# Altium schematic sheet POWERSTAGE.SchDoc
size A4
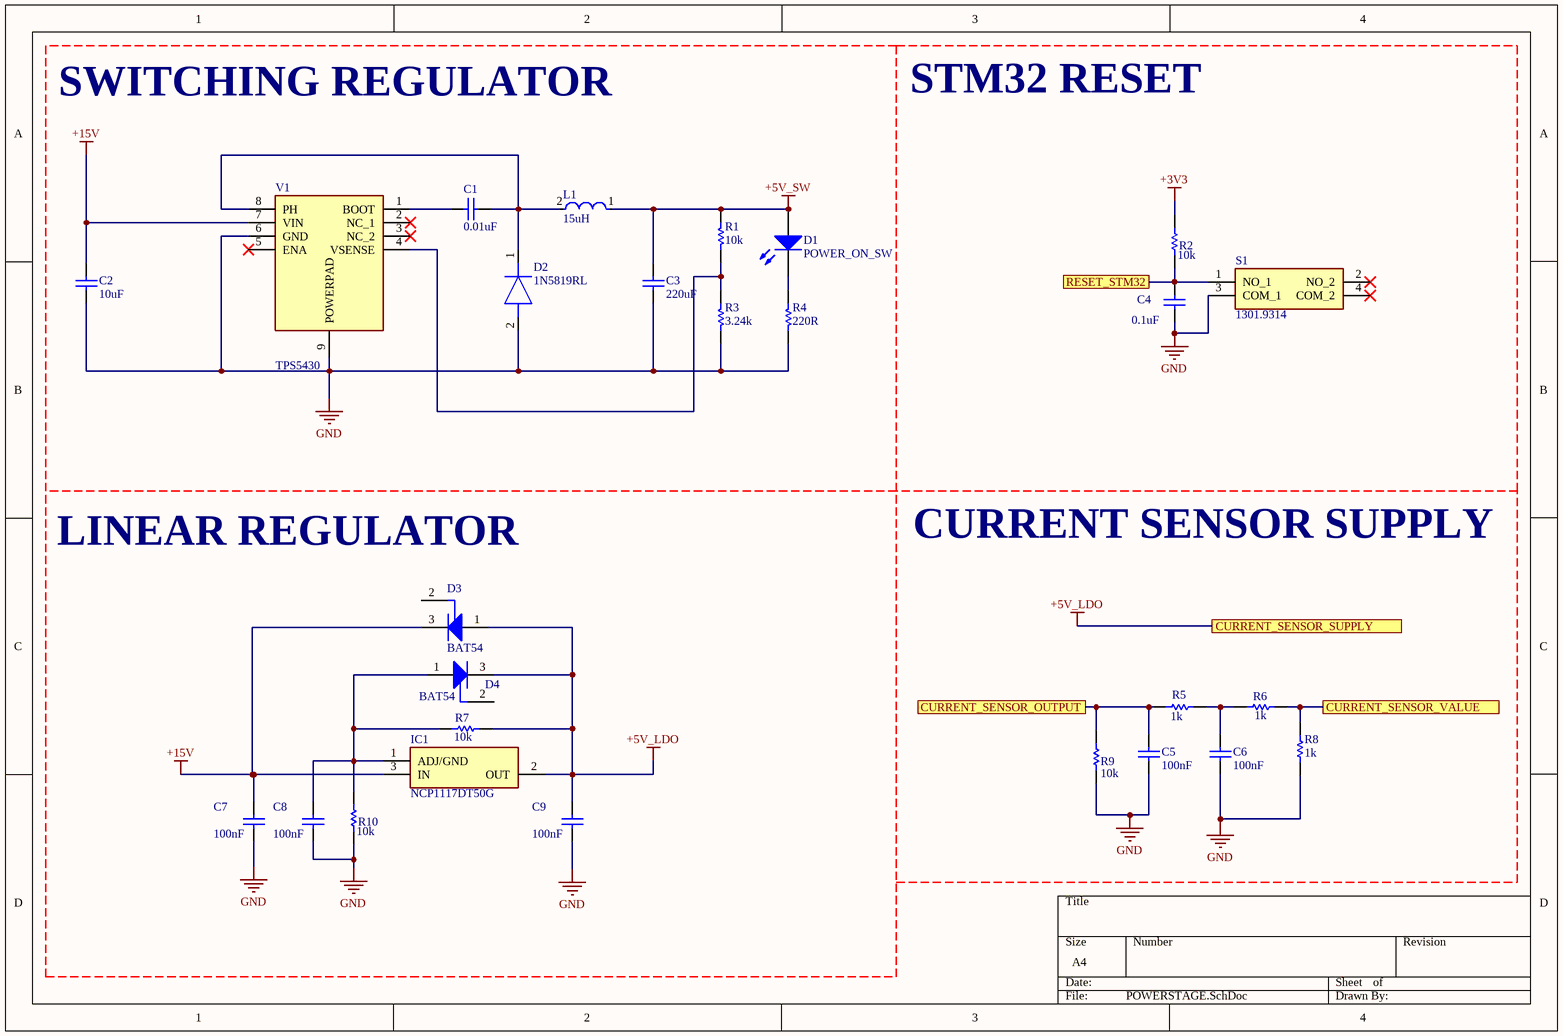
[diagram p0: POWERSTAGE.SchDoc]

## Parts
C1  0.01uF  [KEMT-1206-2_N]
C2  10uF  [KEMT-1206-2_N]
C3  220uF  [KEMT-1206-2_N]
C4  0.1uF  [KEMT-1206-2_N]
C5  100nF  [KEMT-1206-2_N]
C6  100nF  [KEMT-1206-2_N]
C7  100nF  [KEMT-1206-2_N]
C8  100nF  [KEMT-1206-2_N]
C9  100nF  [KEMT-1206-2_N]
D1  POWER_ON_SW  [3.2X1.6X1.1]
D2  1N5819RL  [DIOAD1414W86L464D238]
D3  BAT54  [INF-SOT23_N]
D4  BAT54  [INF-SOT23_N]
IC1  NCP1117DT50G  [LM317MADTRKG]
L1  15uH  [FP-IR02-MFG]
R1  10k  [RESC3216X60X45NL10T20 - duplicate]
R2  10k  [RESC3216X60X45NL10T20 - duplicate]
R3  3.24k  [RESC3216X60X45NL10T20 - duplicate]
R4  220R  [RESC3216X60X45NL10T20 - duplicate]
R5  1k  [R1206]
R6  1k  [R1206]
R7  10k  [RESC3216X60X45NL10T20 - duplicate]
R8  1k  [R1206]
R9  10k  [R1206]
R10  10k  [RESC3216X60X45NL10T20 - duplicate]
S1  1301.9314  [13019319]
V1  TPS5430  [TPS5430]

## Ports
CURRENT_SENSOR_OUTPUT, CURRENT_SENSOR_SUPPLY, CURRENT_SENSOR_VALUE, RESET_STM32

## Nets
+3V3: R2.2
+5V_LDO: C9.1 D3.1(A) D4.3(K) IC1.2(OUT) R7.1 ; port CURRENT_SENSOR_SUPPLY
+5V_SW: C3.2 D1.1(A) L1.1 R1.2
+15V: C2.2 C7.1 D3.3(K) IC1.3(IN) V1.7(VIN)
GND: C2.1 C3.1 C4.1 C5.1 C6.1 C7.2 C8.2 C9.2 D2.2(A) R3.1 R4.1 R8.2 R9.2 R10.1 S1.3(COM_1) V1.6(GND) V1.9(POWERPAD)
CURRENT_SENSOR_OUTPUT: C5.2 R5.2 R9.1 ; port CURRENT_SENSOR_OUTPUT
CURRENT_SENSOR_VALUE: R6.1 R8.1 ; port CURRENT_SENSOR_VALUE
RESET_STM32: C4.2 R2.1 S1.1(NO_1) ; port RESET_STM32
NetC1_1: C1.1 D2.1(K) L1.2 V1.8(PH)
NetC1_2: C1.2 V1.1(BOOT)
NetC6_2: C6.2 R5.1 R6.2
NetC8_1: C8.1 D4.1(A) IC1.1(ADJ/GND) R7.2 R10.2
NetD1_2: D1.2(K) R4.2
NetR1_1: R1.1 R3.2 V1.4(VSENSE)

Not connected (* = marked no-connect by the designer): D3 2(NC); D4 2(NC); S1 2(NO_2)* 4(COM_2)*; V1 2(NC_1)* 3(NC_2)* 5(ENA)*

## Notes on the sheet
- SWITCHING REGULATOR
- STM32 RESET
- LINEAR REGULATOR
- CURRENT SENSOR SUPPLY

## Library data of the parts
C1-C4 = CAPACITOR: CAP, Ceramic, 0.1 uF, +/- 10%, 50 V, -55 to 125 degC, 1206 (3216 Metric), RoHS, Tape and Reel; Manufacturer: Kemet; Voltage Rating: 50V; Capacitance: 0.1µF; Product Range: KEMET-CSeries; SVHC: ToBeAdvised; Dielectric Characteristic: X7R; Capacitor Case Style: 1206[3216Metric]; Package Reference: 1206-2; Package Description: 2-Leads SMD, Body 3.2 x 1.6 mm; Packaging: Tape&Reel; Operating Temperature Max: 125degC; Capacitance Tolerance: ±10%; Datasheet URL: https://datasheet.ciiva.com/6125/1725438-6125494.pdf; Manufacturer URL: http://www.kemet.com/; Operating Temperature Min: -55degC; Datasheet Version: Jul-13
C5-C9 = CMP-1037-04202-2: CAP, Ceramic, 0.1 uF, +/- 10%, 50 V, -55 to 125 degC, 1206 (3216 Metric), RoHS, Tape and Reel; Manufacturer: Kemet; Voltage Rating: 50V; Capacitance: 0.1µF; Product Range: KEMET-CSeries; SVHC: ToBeAdvised; Dielectric Characteristic: X7R; Capacitor Case Style: 1206[3216Metric]; Package Reference: 1206-2; Package Description: 2-Leads SMD, Body 3.2 x 1.6 mm; Packaging: Tape&Reel; Operating Temperature Max: 125degC; Capacitance Tolerance: ±10%; Datasheet URL: https://datasheet.ciiva.com/6125/1725438-6125494.pdf; Manufacturer URL: http://www.kemet.com/; Operating Temperature Min: -55degC; Datasheet Version: Jul-13
D1 = LED2: Typical RED, GREEN, YELLOW, AMBER GaAs LED; Published: 8-Jun-2000; LatestRevisionDate: 17-Jul-2002; LatestRevisionNote: Re-released for DXP Platform.; PackageVersion: Feb-2002; PackageReference: 3.2X1.6X1.1; Publisher: Altium Limited; PackageDescription: SM LED; 2 Flat Leads
D2 = 1N5819RL: Diode; Manufacturer_Name: STMicroelectronics; Datasheet Link: http://www.st.com/web/en/resource/technical/document/datasheet/CD00001625.pdf; Manufacturer_Part_Number: 1N5819RL; Mouser Part Number: 511-1N5819-TR; Mouser Price/Stock: https://www.mouser.co.uk/ProductDetail/STMicroelectronics/1N5819RL?qs=mRqUSD7FX17%2FYMiCEfKDjA%3D%3D; Arrow Part Number: 1N5819RL; Arrow Price/Stock: https://www.arrow.com/en/products/1n5819rl/stmicroelectronics?region=europe
D3 D4 = CMP-1182-00010-1: Silicon Schottky Diode, SOT23, Reel, Green; Manufacturer: Infineon; VF (max): 800Â mV; Configuration: Single; IF (max): 200Â mA; CT (max): 10Â pF; Green: TRUE; VR (max): 30Â V; PartNumber: BAT54; ComponentLink2URL: http://www.infineon.com/dgdl/bat54series.pdf?folderId=db3a30431400ef68011425f1ca2505e3&fileId=db3a304314dca3890115190b74210ea6; ComponentLink3Description: Package Specification; PackageVersion: Apr-08; PackageDescription: 3-Pin Small Outline Transistor Package, 1.3 x 2.9 mm Body, 0.95 mm Pitch; ComponentLink1Description: Manufacturer URL; ComponentLink1URL: http://www.infineon.com/; Mounting Technology: Surface Mount; Packing: Reel; ComponentLink2Description: Datasheet; PackageReference: SOT23; ComponentLink3URL: http://www.infineon.com/dgdl/SOT23-Package_Overview.pdf?folderId=db3a30431936bc4b0119532290053c66&fileId=db3a30431936bc4b0119533468123c85
IC1 = NCP1117DT50G: Integrated Circuit; Manufacturer_Name: onsemi; Datasheet Link: https://componentsearchengine.com/Datasheets/2/NCP1117DT50G.pdf; Height: 2.38mm; Manufacturer_Part_Number: NCP1117DT50G; Mouser Part Number: 863-NCP1117DT50G; Mouser Price/Stock: https://www.mouser.co.uk/ProductDetail/onsemi/NCP1117DT50G?qs=Gev%252BmEvV0iaXyZQB7E2Yhg%3D%3D; Arrow Part Number: NCP1117DT50G; Arrow Price/Stock: https://www.arrow.com/en/products/ncp1117dt50g/on-semiconductor?region=europe
L1 = CMP-03630-000001-1: IR-2 10 10% B08; Obsolete Part: true; Manufacturer: Vishay Dale; Manufacturer Part Number: IR02BH100K; Core Material: Iron; Value: 10uH; Test Frequency: 7.9MHz; Saturation Current: 130mA; Series Resistance: 3.7Ω; Q Factor: 55; Self Resonant Frequency: 50MHz; Device Class L2: Inductors; ComponentLink2Description: Datasheet; Temperature Range Low: -55°C; Digikey Description: IR-2 10 10% B08; Temperature Range High: +105°C; Inductance: 10uH; Height: 3.05mm; Package: IR02; Tolerance: 10%; Device Class L1: Passive Components; Category: Ind; Device Class L3: Fixed Inductors; RoHS: TRUE; Octopart: https://octopart.com/ir02bh100k-vishay+dale-39675774; Temperature: -55°C to +105°C; Ipc Land Pattern Name: CAPAD1147W70L838D305; Lead Free: Yes; ComponentLink2URL: https://datasheet.ciiva.com/8536/ir-8536517.pdf; Automotive: No; Mouser Description: Fixed Inductors 10uH 10%
R1-R4 R7 R10 = CMP-2003-02213-1: Part Number: CRCW120647K0FKEA; Manufacturer: Vishay Dale
R5 R6 R8 R9 = RES: Part Number: CRCW120647K0FKEA; Manufacturer: Vishay Dale
S1 = 1301.9314: Switch; Manufacturer_Name: SCHURTER; Datasheet Link: http://www.mouser.com/datasheet/2/358/typ_6x6_mm_tact_switches-1275689.pdf; Height: 9mm; Manufacturer_Part_Number: 1301.9314; Mouser Part Number: 693-1301.9314; Mouser Price/Stock: https://www.mouser.co.uk/ProductDetail/Schurter/13019314?qs=tGaZrb6HVSbFYC4o6ZpHBA%3D%3D; Arrow Part Number: 1301.9314; Arrow Price/Stock: https://www.arrow.com/en/products/1301.9314/schurter?region=europe